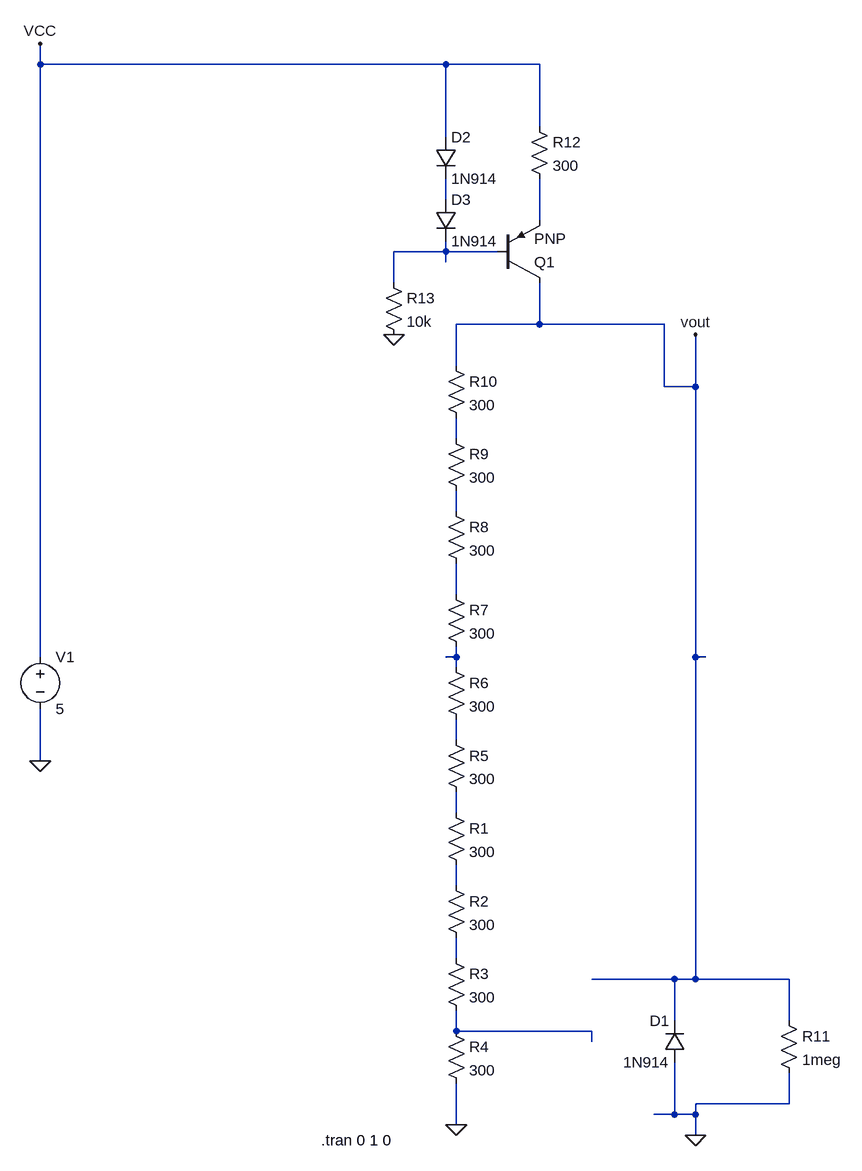
[diagram p0: schematic discrete.asc]
discrete.asc, the LTspice schematic file:
Version 4
SHEET 1 880 680
WIRE -544 -1104 -544 -1136
WIRE 80 -1104 -544 -1104
WIRE 224 -1104 80 -1104
WIRE 224 -1008 224 -1104
WIRE 80 -992 80 -1104
WIRE 80 -896 80 -928
WIRE 224 -864 224 -928
WIRE 80 -816 80 -832
WIRE 80 -816 0 -816
WIRE 160 -816 80 -816
WIRE 80 -800 80 -816
WIRE 0 -768 0 -816
WIRE 224 -704 224 -768
WIRE 224 -704 96 -704
WIRE 416 -704 224 -704
WIRE 96 -640 96 -704
WIRE 416 -608 416 -704
WIRE 464 -608 464 -688
WIRE 464 -608 416 -608
WIRE 96 -528 96 -560
WIRE 96 -416 96 -448
WIRE 96 -288 96 -336
WIRE -544 -192 -544 -1104
WIRE 96 -192 96 -208
WIRE 96 -192 80 -192
WIRE 464 -192 464 -608
WIRE 480 -192 464 -192
WIRE 96 -176 96 -192
WIRE 96 -64 96 -96
WIRE -544 -32 -544 -112
WIRE 96 48 96 16
WIRE 96 160 96 128
WIRE 96 272 96 240
WIRE 432 304 304 304
WIRE 464 304 464 -192
WIRE 464 304 432 304
WIRE 608 304 464 304
WIRE 432 368 432 304
WIRE 608 368 608 304
WIRE 96 384 96 352
WIRE 304 384 96 384
WIRE 304 400 304 384
WIRE 608 496 608 448
WIRE 608 496 464 496
WIRE 432 512 432 432
WIRE 432 512 400 512
WIRE 464 512 464 496
WIRE 464 512 432 512
WIRE 96 528 96 464
WIRE 464 544 464 512
FLAG 96 528 0
FLAG -544 -32 0
FLAG -544 -1136 VCC
FLAG 464 -688 vout
FLAG 464 544 0
FLAG 0 -688 0
SYMBOL res 80 32 R0
SYMATTR InstName R1
SYMATTR Value 300
SYMBOL res 80 144 R0
SYMATTR InstName R2
SYMATTR Value 300
SYMBOL res 80 256 R0
SYMATTR InstName R3
SYMATTR Value 300
SYMBOL res 80 368 R0
SYMATTR InstName R4
SYMATTR Value 300
SYMBOL res 80 -80 R0
SYMATTR InstName R5
SYMATTR Value 300
SYMBOL res 80 -192 R0
SYMATTR InstName R6
SYMATTR Value 300
SYMBOL res 80 -304 R0
SYMATTR InstName R7
SYMATTR Value 300
SYMBOL voltage -544 -208 R0
WINDOW 123 0 0 Left 2
WINDOW 39 0 0 Left 2
SYMATTR InstName V1
SYMATTR Value 5
SYMBOL res 80 -432 R0
SYMATTR InstName R8
SYMATTR Value 300
SYMBOL res 80 -544 R0
SYMATTR InstName R9
SYMATTR Value 300
SYMBOL res 80 -656 R0
SYMATTR InstName R10
SYMATTR Value 300
SYMBOL res 592 352 R0
SYMATTR InstName R11
SYMATTR Value 1meg
SYMBOL diode 448 432 R180
WINDOW 0 24 64 Left 2
WINDOW 3 24 0 Left 2
SYMATTR InstName D1
SYMATTR Value 1N914
SYMBOL diode 64 -992 R0
SYMATTR InstName D2
SYMATTR Value 1N914
SYMBOL diode 64 -896 R0
SYMATTR InstName D3
SYMATTR Value 1N914
SYMBOL res 208 -1024 R0
SYMATTR InstName R12
SYMATTR Value 300
SYMBOL res -16 -784 R0
SYMATTR InstName R13
SYMATTR Value 10k
SYMBOL pnp 160 -768 M180
SYMATTR InstName Q1
TEXT -112 552 Left 2 !.tran 0 1 0

The netlist it stands for:
* discrete.asc
R1 N009 N010 300
R2 N010 N011 300
R3 N011 N012 300
R4 N012 0 300
R5 N008 N009 300
R6 N007 N008 300
R7 N006 N007 300
V1 VCC 0 5
R8 N005 N006 300
R9 N004 N005 300
R10 vout N004 300
R11 vout 0 1meg
D1 0 vout 1N914
D2 VCC N001 1N914
D3 N001 N003 1N914
R12 VCC N002 300
R13 N003 0 10k
Q1 vout N003 N002 0 PNP
.model D D
.lib standard.dio
.model NPN NPN
.model PNP PNP
.lib standard.bjt
.tran 0 1 0
.backanno
.end